# Altium schematic sheet End Stops.SchDoc
size B; DrawnBy: Ross Harvey; Revision: A; SheetNumber: 5
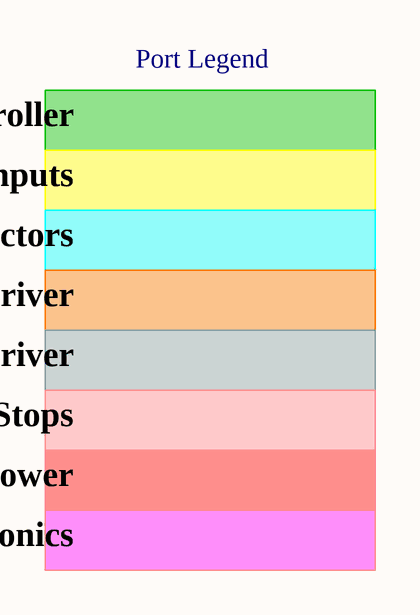
[diagram p0: End Stops.SchDoc]

## Notes on the sheet
- Microcontroller
- Port Legend
- Inputs
- Connectors
- Motor A Driver
- Motor B Driver
- End Stops
- Power
- Ultrasonics